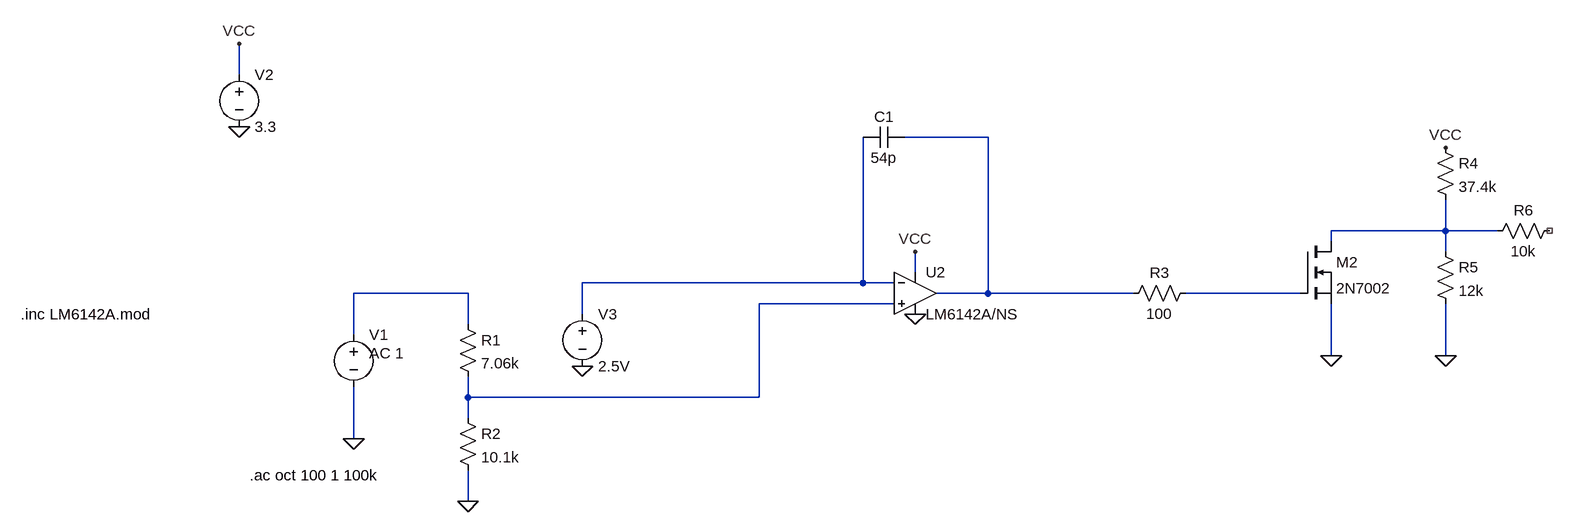
[diagram p0: schematic Flight_Voltage_Limit.asc]
Flight_Voltage_Limit.asc, the LTspice schematic file:
Version 4
SHEET 1 1912 680
WIRE -112 -304 -112 -352
WIRE 1040 -208 912 -208
WIRE 1744 -64 1744 -112
WIRE 1744 -64 1568 -64
WIRE 1824 -64 1744 -64
WIRE 1568 -48 1568 -64
WIRE 1744 -32 1744 -64
WIRE 928 0 928 -32
WIRE 848 16 848 -208
WIRE 848 16 416 16
WIRE 896 16 848 16
WIRE 240 32 64 32
WIRE 1040 32 1040 -208
WIRE 1040 32 960 32
WIRE 1264 32 1040 32
WIRE 1520 32 1344 32
WIRE 896 48 688 48
WIRE 416 64 416 16
WIRE 240 80 240 32
WIRE 64 96 64 32
WIRE 1568 128 1568 48
WIRE 1744 128 1744 48
WIRE 240 192 240 160
WIRE 688 192 688 48
WIRE 688 192 240 192
WIRE 240 224 240 192
WIRE 64 256 64 176
WIRE 240 352 240 304
FLAG -112 -224 0
FLAG 64 256 0
FLAG -112 -352 VCC
FLAG 928 -32 VCC
FLAG 928 64 0
FLAG 416 144 0
FLAG 240 352 0
FLAG 1568 128 0
FLAG 1744 128 0
FLAG 1744 -192 VCC
SYMBOL voltage 64 80 R0
WINDOW 123 24 44 Left 2
WINDOW 39 0 0 Left 2
SYMATTR Value2 AC 1
SYMATTR InstName V1
SYMATTR Value ""
SYMBOL voltage -112 -320 R0
WINDOW 123 0 0 Left 2
WINDOW 39 0 0 Left 2
SYMATTR InstName V2
SYMATTR Value 3.3
SYMBOL Opamps\\opamp2 928 -32 R0
SYMATTR InstName U2
SYMATTR Value LM6142A/NS
SYMBOL voltage 416 48 R0
WINDOW 123 0 0 Left 2
WINDOW 39 0 0 Left 2
SYMATTR InstName V3
SYMATTR Value 2.5V
SYMBOL res 224 64 R0
SYMATTR InstName R1
SYMATTR Value 7.06k
SYMBOL res 224 208 R0
SYMATTR InstName R2
SYMATTR Value 10.1k
SYMBOL cap 912 -224 R90
WINDOW 0 0 32 VBottom 2
WINDOW 3 32 32 VTop 2
SYMATTR InstName C1
SYMATTR Value 54p
SYMBOL res 1360 16 R90
WINDOW 0 0 56 VBottom 2
WINDOW 3 32 56 VTop 2
SYMATTR InstName R3
SYMATTR Value 100
SYMBOL nmos 1520 -48 R0
SYMATTR InstName M2
SYMATTR Value 2N7002
SYMBOL res 1728 -208 R0
SYMATTR InstName R4
SYMATTR Value 37.4k
SYMBOL res 1728 -48 R0
SYMATTR InstName R5
SYMATTR Value 12k
SYMBOL res 1920 -80 R90
WINDOW 0 0 56 VBottom 2
WINDOW 3 32 56 VTop 2
SYMATTR InstName R6
SYMATTR Value 10k
TEXT -96 312 Left 2 !.ac oct 100 1 100k
TEXT -448 64 Left 2 !.inc LM6142A.mod

The netlist it stands for:
* Flight_Voltage_Limit.asc
V1 N004 0 AC 1
V2 VCC 0 3.3
XU2 N006 N003 VCC 0 N001 LM6142A/NS  ; pins In+ In- V+ V- OUT
V3 N003 0 2.5V
R1 N004 N006 7.06k
R2 N006 0 10.1k
C1 N001 N003 54p
R3 N005 N001 100
M2 N002 N005 0 0 2N7002
R4 VCC N002 37.4k
R5 N002 0 12k
R6 NC_01 N002 10k
.model NMOS NMOS
.model PMOS PMOS
.lib standard.mos
.ac oct 100 1 100k
.inc LM6142A.mod
.backanno
.end